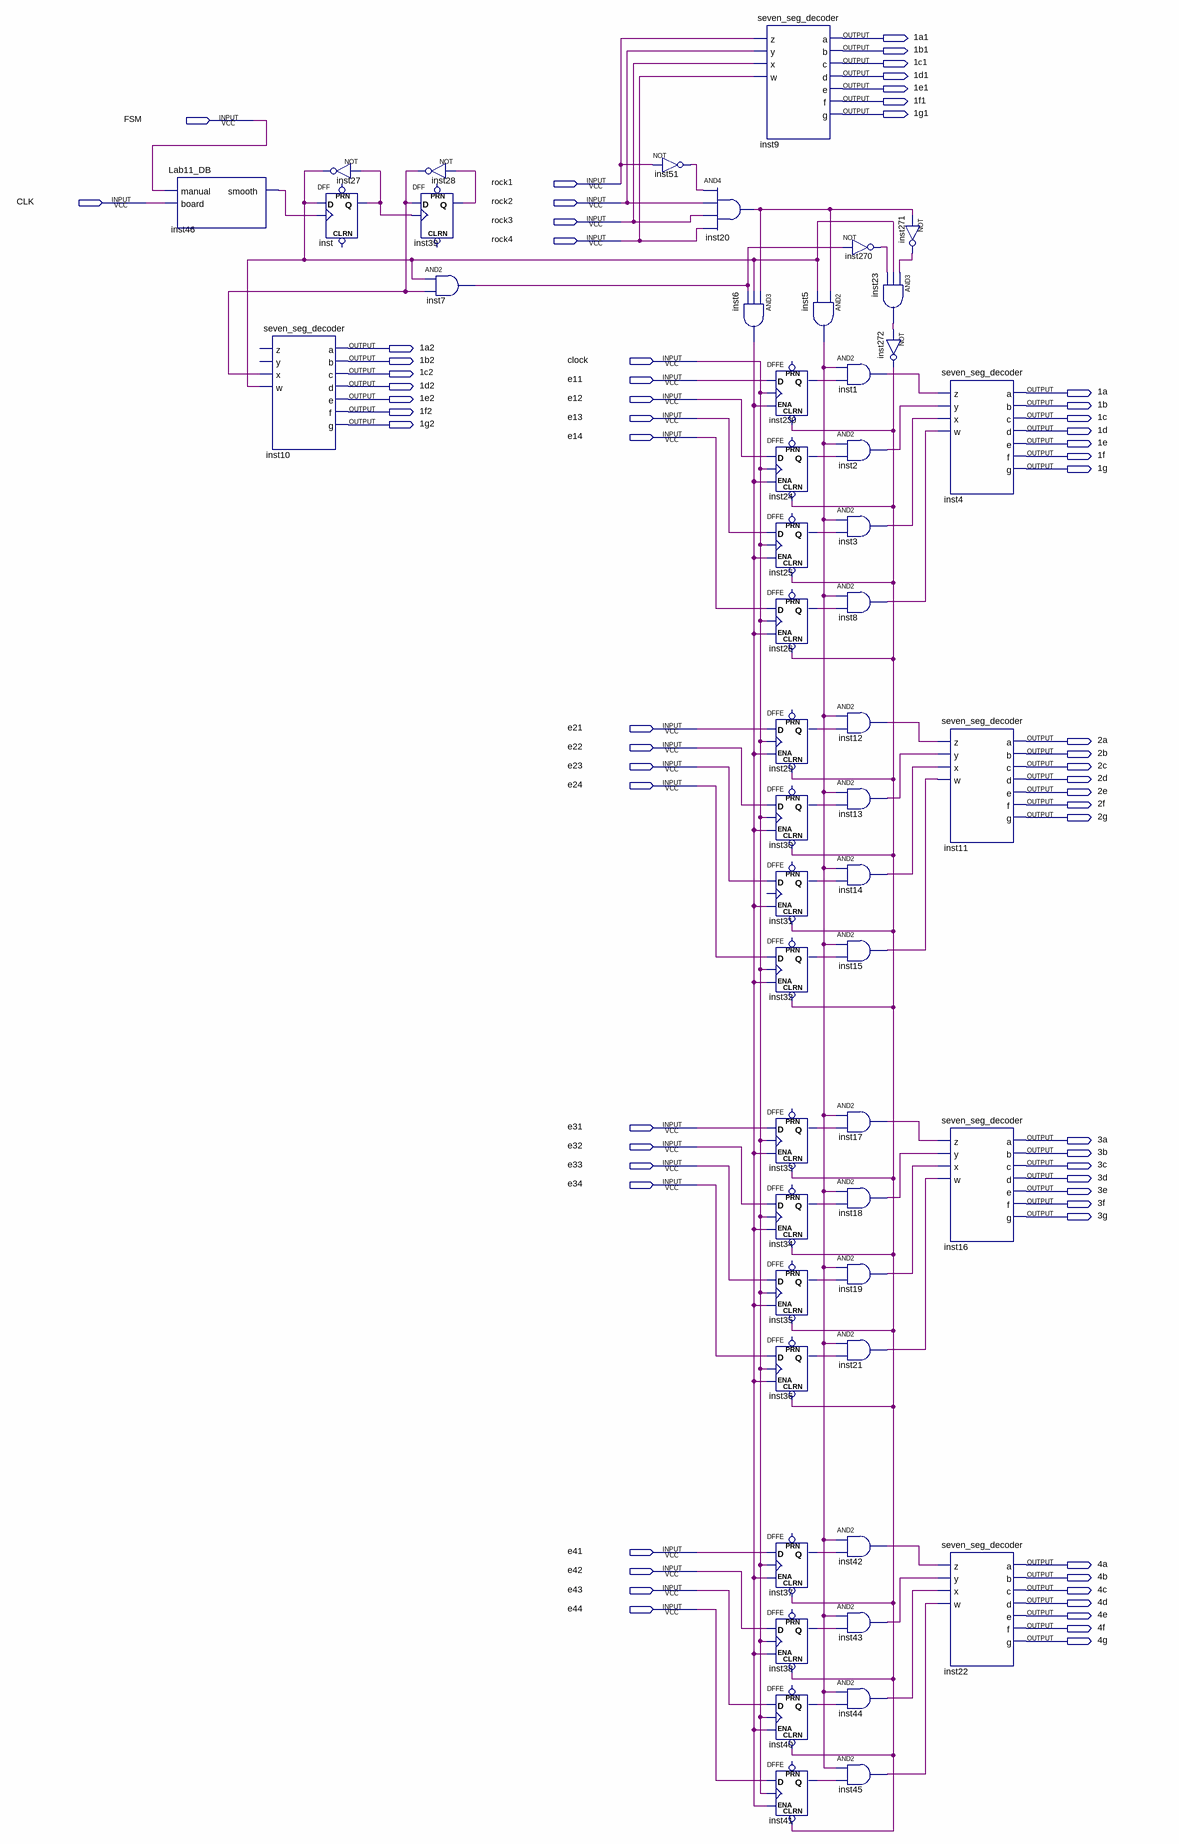
[diagram p0: schematic sheet]
// Quartus schematic Final_Proj.bdf as structural Verilog: 52 symbols, 65 pins
module Final_Proj (
  input  FSM,
  input  rock1,
  input  CLK,
  input  rock2,
  input  rock3,
  input  rock4,
  input  clock,
  input  e11,
  input  e12,
  input  e13,
  input  e14,
  input  e21,
  input  e22,
  input  e23,
  input  e24,
  input  e31,
  input  e32,
  input  e33,
  input  e34,
  input  e41,
  input  e42,
  input  e43,
  input  e44,
  output \1a1 ,
  output \1b1 ,
  output \1c1 ,
  output \1d1 ,
  output \1e1 ,
  output \1f1 ,
  output \1g1 ,
  output \1a2 ,
  output \1b2 ,
  output \1c2 ,
  output \1d2 ,
  output \1a ,
  output \1e2 ,
  output \1b ,
  output \1f2 ,
  output \1c ,
  output \1g2 ,
  output \1d ,
  output \1e ,
  output \1f ,
  output \1g ,
  output \2a ,
  output \2b ,
  output \2c ,
  output \2d ,
  output \2e ,
  output \2f ,
  output \2g ,
  output \3a ,
  output \3b ,
  output \3c ,
  output \3d ,
  output \3e ,
  output \3f ,
  output \3g ,
  output \4a ,
  output \4b ,
  output \4c ,
  output \4d ,
  output \4e ,
  output \4f ,
  output \4g 
);

  wire inst1_out, inst2_out, inst3_out, inst5_out, inst6_out, inst7_out, inst8_out, inst12_out, inst13_out,
       inst14_out, inst15_out, inst17_out, inst18_out, inst19_out, inst20_out, inst21_out, inst23_out,
       inst24_q, inst25_q, inst26_q, inst27_out, inst28_out, inst29_q, inst30_q, inst31_q, inst32_q,
       inst33_q, inst34_q, inst35_q, inst36_q, inst37_q, inst38_q, inst39_q, inst40_q, inst41_q, inst42_out,
       inst43_out, inst44_out, inst45_out, inst46_smooth, inst51_out, inst230_q, inst270_out, inst271_out,
       inst272_out, inst_q;

  Lab11_DB inst46 (.manual(FSM), .board(CLK), .smooth(inst46_smooth));
  seven_seg_decoder inst10 (
    .x(inst28_out), .w(inst27_out), .a(\1a2 ), .b(\1b2 ), .c(\1c2 ), .d(\1d2 ), .e(\1e2 ), .f(\1f2 ),
    .g(\1g2 ));  // open: z, y
  not inst27 (inst27_out, inst_q);
  DFF inst (.CLK(inst46_smooth), .D(inst27_out), .Q(inst_q));  // open: CLRN, PRN
  not inst28 (inst28_out, inst39_q);
  DFF inst39 (.CLK(inst_q), .D(inst28_out), .Q(inst39_q));  // open: CLRN, PRN
  and inst7 (inst7_out, inst27_out, inst28_out);
  not inst51 (inst51_out, rock1);
  and inst20 (inst20_out, inst51_out, rock2, rock3, rock4);
  and inst6 (inst6_out, inst20_out, inst27_out, inst7_out);
  seven_seg_decoder inst9 (
    .z(rock1), .y(rock2), .x(rock3), .w(rock4), .a(\1a1 ), .b(\1b1 ), .c(\1c1 ), .d(\1d1 ), .e(\1e1 ),
    .f(\1f1 ), .g(\1g1 ));
  DFFE inst230 (.CLRN(inst272_out), .D(e11), .CLK(clock), .ENA(inst6_out), .Q(inst230_q));  // open: PRN
  DFFE inst24 (.CLRN(inst272_out), .D(e12), .CLK(clock), .ENA(inst6_out), .Q(inst24_q));  // open: PRN
  DFFE inst25 (.CLRN(inst272_out), .D(e13), .CLK(clock), .ENA(inst6_out), .Q(inst25_q));  // open: PRN
  DFFE inst26 (.CLRN(inst272_out), .D(e14), .CLK(clock), .ENA(inst6_out), .Q(inst26_q));  // open: PRN
  DFFE inst29 (.CLRN(inst272_out), .D(e21), .CLK(clock), .ENA(inst6_out), .Q(inst29_q));  // open: PRN
  DFFE inst30 (.CLRN(inst272_out), .D(e22), .CLK(clock), .ENA(inst6_out), .Q(inst30_q));  // open: PRN
  DFFE inst31 (.CLRN(inst272_out), .D(e23), .ENA(inst6_out), .Q(inst31_q));  // open: PRN, CLK
  DFFE inst32 (.CLRN(inst272_out), .D(e24), .CLK(clock), .ENA(inst6_out), .Q(inst32_q));  // open: PRN
  DFFE inst33 (.CLRN(inst272_out), .D(e31), .CLK(clock), .ENA(inst6_out), .Q(inst33_q));  // open: PRN
  DFFE inst34 (.CLRN(inst272_out), .D(e32), .CLK(clock), .ENA(inst6_out), .Q(inst34_q));  // open: PRN
  DFFE inst35 (.CLRN(inst272_out), .D(e33), .CLK(clock), .ENA(inst6_out), .Q(inst35_q));  // open: PRN
  DFFE inst36 (.CLRN(inst272_out), .D(e34), .CLK(clock), .ENA(inst6_out), .Q(inst36_q));  // open: PRN
  DFFE inst37 (.CLRN(inst272_out), .D(e41), .CLK(clock), .ENA(inst6_out), .Q(inst37_q));  // open: PRN
  DFFE inst38 (.CLRN(inst272_out), .D(e42), .CLK(clock), .ENA(inst6_out), .Q(inst38_q));  // open: PRN
  DFFE inst40 (.CLRN(inst272_out), .D(e43), .CLK(clock), .ENA(inst6_out), .Q(inst40_q));  // open: PRN
  DFFE inst41 (.CLRN(inst272_out), .D(e44), .CLK(clock), .ENA(inst6_out), .Q(inst41_q));  // open: PRN
  not inst270 (inst270_out, inst7_out);
  and inst5 (inst5_out, inst20_out, inst27_out);
  and inst1 (inst1_out, inst5_out, inst230_q);
  and inst2 (inst2_out, inst5_out, inst24_q);
  and inst3 (inst3_out, inst5_out, inst25_q);
  and inst8 (inst8_out, inst5_out, inst26_q);
  and inst12 (inst12_out, inst5_out, inst29_q);
  and inst13 (inst13_out, inst5_out, inst30_q);
  and inst14 (inst14_out, inst5_out, inst31_q);
  and inst15 (inst15_out, inst5_out, inst32_q);
  and inst17 (inst17_out, inst5_out, inst33_q);
  and inst18 (inst18_out, inst5_out, inst34_q);
  and inst19 (inst19_out, inst5_out, inst35_q);
  and inst21 (inst21_out, inst5_out, inst36_q);
  and inst42 (inst42_out, inst5_out, inst37_q);
  and inst43 (inst43_out, inst5_out, inst38_q);
  and inst44 (inst44_out, inst5_out, inst40_q);
  and inst45 (inst45_out, inst5_out, inst41_q);
  and inst23 (inst23_out, inst271_out, inst27_out, inst270_out);
  not inst272 (inst272_out, inst23_out);
  not inst271 (inst271_out, inst20_out);
  seven_seg_decoder inst4 (
    .z(inst1_out), .y(inst2_out), .x(inst3_out), .w(inst8_out), .a(\1a ), .b(\1b ), .c(\1c ), .d(\1d ),
    .e(\1e ), .f(\1f ), .g(\1g ));
  seven_seg_decoder inst11 (
    .z(inst12_out), .y(inst13_out), .x(inst14_out), .w(inst15_out), .a(\2a ), .b(\2b ), .c(\2c ), .d(\2d ),
    .e(\2e ), .f(\2f ), .g(\2g ));
  seven_seg_decoder inst16 (
    .z(inst17_out), .y(inst18_out), .x(inst19_out), .w(inst21_out), .a(\3a ), .b(\3b ), .c(\3c ), .d(\3d ),
    .e(\3e ), .f(\3f ), .g(\3g ));
  seven_seg_decoder inst22 (
    .z(inst42_out), .y(inst43_out), .x(inst44_out), .w(inst45_out), .a(\4a ), .b(\4b ), .c(\4c ), .d(\4d ),
    .e(\4e ), .f(\4f ), .g(\4g ));
endmodule
